# Altium schematic sheet Top.SchDoc
size A4
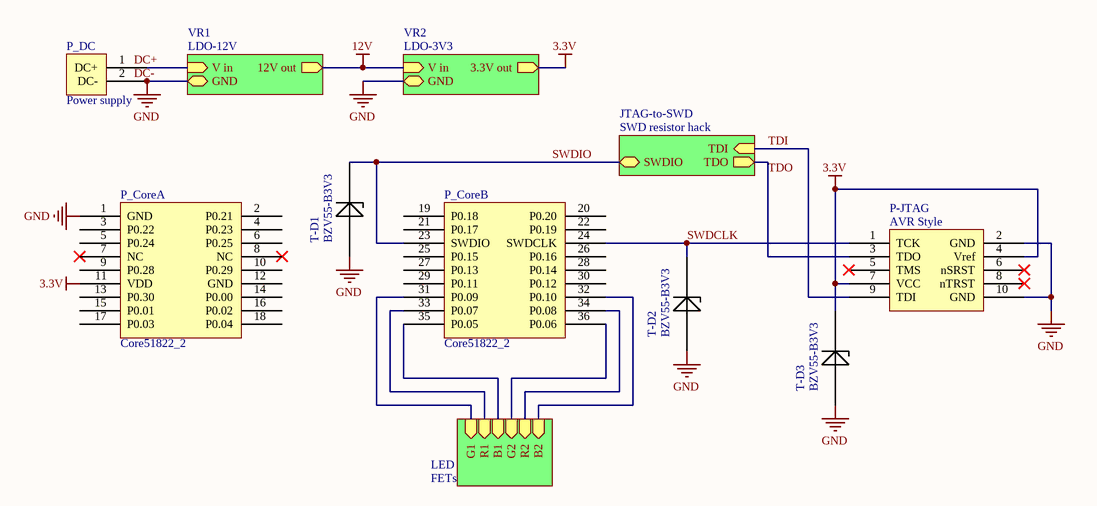
[diagram p0: Top.SchDoc]

## Parts
P-JTAG  AVR Style  [Header 2x5 IDC-10S]
P_Core  Core51822_2  [Core51822]  (parts A,B of 2)
P_DC  Power supply  [DC cable pad with holes]
T-D1  BZV55-B3V3  [Minimelf]
T-D2  BZV55-B3V3  [Minimelf]
T-D3  BZV55-B3V3  [Minimelf]

## Sub-sheets
JTAG-to-SWD = SWD resistor hack: SWDIO (bidir), TDO (out), TDI (in)
LED = FETs: G1 (in), R1 (in), B1 (in), B2 (in), G2 (in), R2 (in)
VR1 = LDO-12V: 12V out (out), GND, V in (in)
VR2 = LDO-3V3: 3.3V out (out), GND, V in (in)

## Nets
3.3V: P-JTAG.4(Vref) P-JTAG.7(VCC) P_Core.11(VDD) T-D3.1 ; sheet VR2/3.3V out
12V: sheet VR2/V in, sheet VR1/12V out
GND: P-JTAG.2(GND) P-JTAG.10(GND) P_Core.1(GND) P_DC.2(DC-) T-D1.2 T-D2.2 T-D3.2 ; sheet VR2/GND, sheet VR1/GND
SWDCLK: P-JTAG.1(TCK) P_Core.24(SWDCLK) T-D2.1
SWDIO: P_Core.23(SWDIO) T-D1.1 ; sheet JTAG-to-SWD/SWDIO
TDI: P-JTAG.9(TDI) ; sheet JTAG-to-SWD/TDI
TDO: P-JTAG.3(TDO) ; sheet JTAG-to-SWD/TDO
NetP_Core_31: P_Core.31(P0.09) ; sheet LED/G1
NetP_Core_32: P_Core.32(P0.10) ; sheet LED/B2
NetP_Core_33: P_Core.33(P0.07) ; sheet LED/R1
NetP_Core_34: P_Core.34(P0.08) ; sheet LED/R2
NetP_Core_35: P_Core.35(P0.05) ; sheet LED/B1
NetP_Core_36: P_Core.36(P0.06) ; sheet LED/G2
NetP_DC_1: P_DC.1(DC+) ; sheet VR1/V in

Not connected (* = marked no-connect by the designer): P-JTAG 5(TMS)* 6(nSRST)* 8(nTRST)*; P_Core 2(P0.21) 3(P0.22) 4(P0.23) 5(P0.24) 6(P0.25) 7(NC)* 8(NC)* 9(P0.28) 10(P0.29) 12(GND) 13(P0.30) 14(P0.00) 15(P0.01) 16(P0.02) 17(P0.03) 18(P0.04) 19(P0.18) 20(P0.20) 21(P0.17) 22(P0.19) 25(P0.15) 26(P0.16) 27(P0.13) 28(P0.14) 29(P0.11) 30(P0.12)

## Notes on the sheet
- Labels drawn without touching a wire or pin: DC+, DC-

## Library data of the parts
P-JTAG = Header JTAG AVR
T-D1-T-D3 = Zener Diode